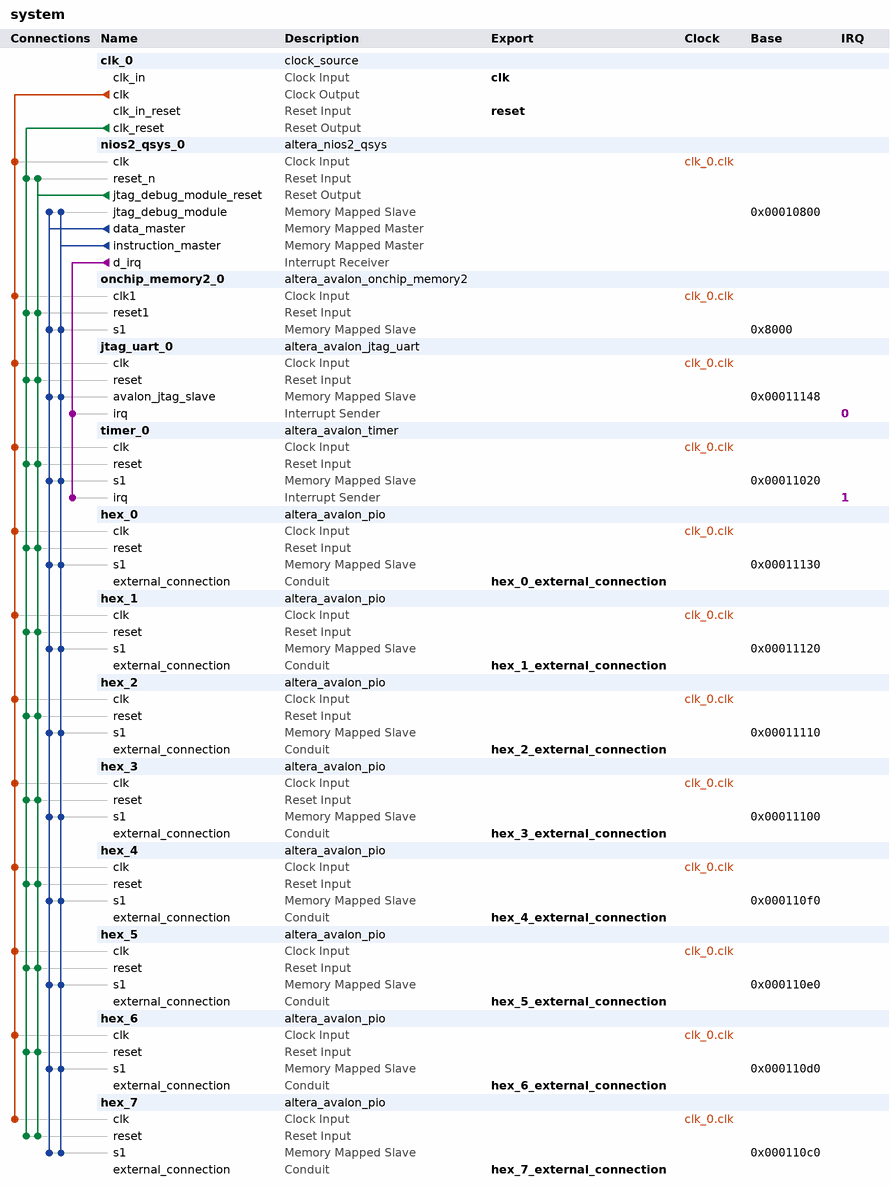
[diagram p0: system contents]
# Platform Designer (Qsys) system system, Cyclone IV E EP4CE115F29C8
# Parameters at their usual value, and those the tool derives, are not listed.
package require -exact qsys 13.0.1.99.2
create_system system
set_project_property DEVICE_FAMILY {Cyclone IV E}
set_project_property DEVICE EP4CE115F29C8

add_instance clk_0 clock_source 13.0
set_instance_parameter_value clk_0 clockFrequency 50000000

add_instance nios2_qsys_0 altera_nios2_qsys 13.0
set_instance_parameter_value nios2_qsys_0 resetSlave onchip_memory2_0.s1
set_instance_parameter_value nios2_qsys_0 mmu_TLBMissExcSlave None
set_instance_parameter_value nios2_qsys_0 exceptionSlave onchip_memory2_0.s1
set_instance_parameter_value nios2_qsys_0 breakSlave nios2_qsys_0.jtag_debug_module
set_instance_parameter_value nios2_qsys_0 impl Tiny
set_instance_parameter_value nios2_qsys_0 icache_size 4096

add_instance onchip_memory2_0 altera_avalon_onchip_memory2 13.0.1.99.2
set_instance_parameter_value onchip_memory2_0 dataWidth 32
set_instance_parameter_value onchip_memory2_0 dualPort false
set_instance_parameter_value onchip_memory2_0 initMemContent true
set_instance_parameter_value onchip_memory2_0 initializationFileName onchip_mem.hex
set_instance_parameter_value onchip_memory2_0 memorySize 32768

add_instance jtag_uart_0 altera_avalon_jtag_uart 13.0.1.99.2
set_instance_parameter_value jtag_uart_0 simInteractiveOptions NO_INTERACTIVE_WINDOWS

add_instance timer_0 altera_avalon_timer 13.0.1.99.2
set_instance_parameter_value timer_0 period 1
set_instance_parameter_value timer_0 periodUnits MSEC

add_instance hex_0 altera_avalon_pio 13.0.1.99.2
set_instance_parameter_value hex_0 direction Output
set_instance_parameter_value hex_0 width 7

add_instance hex_1 altera_avalon_pio 13.0.1.99.2
set_instance_parameter_value hex_1 direction Output
set_instance_parameter_value hex_1 width 7

add_instance hex_2 altera_avalon_pio 13.0.1.99.2
set_instance_parameter_value hex_2 direction Output
set_instance_parameter_value hex_2 width 7

add_instance hex_3 altera_avalon_pio 13.0.1.99.2
set_instance_parameter_value hex_3 direction Output
set_instance_parameter_value hex_3 width 7

add_instance hex_4 altera_avalon_pio 13.0.1.99.2
set_instance_parameter_value hex_4 direction Output
set_instance_parameter_value hex_4 width 7

add_instance hex_5 altera_avalon_pio 13.0.1.99.2
set_instance_parameter_value hex_5 direction Output
set_instance_parameter_value hex_5 width 7

add_instance hex_6 altera_avalon_pio 13.0.1.99.2
set_instance_parameter_value hex_6 direction Output
set_instance_parameter_value hex_6 width 7

add_instance hex_7 altera_avalon_pio 13.0.1.99.2
set_instance_parameter_value hex_7 direction Output
set_instance_parameter_value hex_7 width 7

# connections
add_connection clk_0.clk hex_0.clk clock
add_connection clk_0.clk hex_1.clk clock
add_connection clk_0.clk hex_2.clk clock
add_connection clk_0.clk hex_3.clk clock
add_connection clk_0.clk hex_4.clk clock
add_connection clk_0.clk hex_5.clk clock
add_connection clk_0.clk hex_6.clk clock
add_connection clk_0.clk hex_7.clk clock
add_connection clk_0.clk jtag_uart_0.clk clock
add_connection clk_0.clk nios2_qsys_0.clk clock
add_connection clk_0.clk onchip_memory2_0.clk1 clock
add_connection clk_0.clk timer_0.clk clock
add_connection clk_0.clk_reset hex_0.reset reset
add_connection clk_0.clk_reset hex_1.reset reset
add_connection clk_0.clk_reset hex_2.reset reset
add_connection clk_0.clk_reset hex_3.reset reset
add_connection clk_0.clk_reset hex_4.reset reset
add_connection clk_0.clk_reset hex_5.reset reset
add_connection clk_0.clk_reset hex_6.reset reset
add_connection clk_0.clk_reset hex_7.reset reset
add_connection clk_0.clk_reset jtag_uart_0.reset reset
add_connection clk_0.clk_reset nios2_qsys_0.reset_n reset
add_connection clk_0.clk_reset onchip_memory2_0.reset1 reset
add_connection clk_0.clk_reset timer_0.reset reset
add_connection nios2_qsys_0.jtag_debug_module_reset hex_0.reset reset
add_connection nios2_qsys_0.jtag_debug_module_reset hex_1.reset reset
add_connection nios2_qsys_0.jtag_debug_module_reset hex_2.reset reset
add_connection nios2_qsys_0.jtag_debug_module_reset hex_3.reset reset
add_connection nios2_qsys_0.jtag_debug_module_reset hex_4.reset reset
add_connection nios2_qsys_0.jtag_debug_module_reset hex_5.reset reset
add_connection nios2_qsys_0.jtag_debug_module_reset hex_6.reset reset
add_connection nios2_qsys_0.jtag_debug_module_reset hex_7.reset reset
add_connection nios2_qsys_0.jtag_debug_module_reset jtag_uart_0.reset reset
add_connection nios2_qsys_0.jtag_debug_module_reset nios2_qsys_0.reset_n reset
add_connection nios2_qsys_0.jtag_debug_module_reset onchip_memory2_0.reset1 reset
add_connection nios2_qsys_0.jtag_debug_module_reset timer_0.reset reset
add_connection nios2_qsys_0.data_master hex_0.s1 avalon
set_connection_parameter_value nios2_qsys_0.data_master/hex_0.s1 baseAddress 0x00011130
add_connection nios2_qsys_0.data_master hex_1.s1 avalon
set_connection_parameter_value nios2_qsys_0.data_master/hex_1.s1 baseAddress 0x00011120
add_connection nios2_qsys_0.data_master hex_2.s1 avalon
set_connection_parameter_value nios2_qsys_0.data_master/hex_2.s1 baseAddress 0x00011110
add_connection nios2_qsys_0.data_master hex_3.s1 avalon
set_connection_parameter_value nios2_qsys_0.data_master/hex_3.s1 baseAddress 0x00011100
add_connection nios2_qsys_0.data_master hex_4.s1 avalon
set_connection_parameter_value nios2_qsys_0.data_master/hex_4.s1 baseAddress 0x000110f0
add_connection nios2_qsys_0.data_master hex_5.s1 avalon
set_connection_parameter_value nios2_qsys_0.data_master/hex_5.s1 baseAddress 0x000110e0
add_connection nios2_qsys_0.data_master hex_6.s1 avalon
set_connection_parameter_value nios2_qsys_0.data_master/hex_6.s1 baseAddress 0x000110d0
add_connection nios2_qsys_0.data_master hex_7.s1 avalon
set_connection_parameter_value nios2_qsys_0.data_master/hex_7.s1 baseAddress 0x000110c0
add_connection nios2_qsys_0.data_master jtag_uart_0.avalon_jtag_slave avalon
set_connection_parameter_value nios2_qsys_0.data_master/jtag_uart_0.avalon_jtag_slave baseAddress 0x00011148
add_connection nios2_qsys_0.data_master nios2_qsys_0.jtag_debug_module avalon
set_connection_parameter_value nios2_qsys_0.data_master/nios2_qsys_0.jtag_debug_module baseAddress 0x00010800
add_connection nios2_qsys_0.data_master onchip_memory2_0.s1 avalon
set_connection_parameter_value nios2_qsys_0.data_master/onchip_memory2_0.s1 baseAddress 0x8000
add_connection nios2_qsys_0.data_master timer_0.s1 avalon
set_connection_parameter_value nios2_qsys_0.data_master/timer_0.s1 baseAddress 0x00011020
add_connection nios2_qsys_0.instruction_master hex_0.s1 avalon
set_connection_parameter_value nios2_qsys_0.instruction_master/hex_0.s1 baseAddress 0x00011130
add_connection nios2_qsys_0.instruction_master hex_1.s1 avalon
set_connection_parameter_value nios2_qsys_0.instruction_master/hex_1.s1 baseAddress 0x00011120
add_connection nios2_qsys_0.instruction_master hex_2.s1 avalon
set_connection_parameter_value nios2_qsys_0.instruction_master/hex_2.s1 baseAddress 0x00011110
add_connection nios2_qsys_0.instruction_master hex_3.s1 avalon
set_connection_parameter_value nios2_qsys_0.instruction_master/hex_3.s1 baseAddress 0x00011100
add_connection nios2_qsys_0.instruction_master hex_4.s1 avalon
set_connection_parameter_value nios2_qsys_0.instruction_master/hex_4.s1 baseAddress 0x000110f0
add_connection nios2_qsys_0.instruction_master hex_5.s1 avalon
set_connection_parameter_value nios2_qsys_0.instruction_master/hex_5.s1 baseAddress 0x000110e0
add_connection nios2_qsys_0.instruction_master hex_6.s1 avalon
set_connection_parameter_value nios2_qsys_0.instruction_master/hex_6.s1 baseAddress 0x000110d0
add_connection nios2_qsys_0.instruction_master hex_7.s1 avalon
set_connection_parameter_value nios2_qsys_0.instruction_master/hex_7.s1 baseAddress 0x000110c0
add_connection nios2_qsys_0.instruction_master jtag_uart_0.avalon_jtag_slave avalon
set_connection_parameter_value nios2_qsys_0.instruction_master/jtag_uart_0.avalon_jtag_slave baseAddress 0x00011148
add_connection nios2_qsys_0.instruction_master nios2_qsys_0.jtag_debug_module avalon
set_connection_parameter_value nios2_qsys_0.instruction_master/nios2_qsys_0.jtag_debug_module baseAddress 0x00010800
add_connection nios2_qsys_0.instruction_master onchip_memory2_0.s1 avalon
set_connection_parameter_value nios2_qsys_0.instruction_master/onchip_memory2_0.s1 baseAddress 0x8000
add_connection nios2_qsys_0.instruction_master timer_0.s1 avalon
set_connection_parameter_value nios2_qsys_0.instruction_master/timer_0.s1 baseAddress 0x00011020
add_connection nios2_qsys_0.d_irq jtag_uart_0.irq interrupt
set_connection_parameter_value nios2_qsys_0.d_irq/jtag_uart_0.irq irqNumber 0
add_connection nios2_qsys_0.d_irq timer_0.irq interrupt
set_connection_parameter_value nios2_qsys_0.d_irq/timer_0.irq irqNumber 1

# exported interfaces
add_interface clk clock sink
set_interface_property clk EXPORT_OF clk_0.clk_in
add_interface reset reset sink
set_interface_property reset EXPORT_OF clk_0.clk_in_reset
add_interface hex_0_external_connection conduit end
set_interface_property hex_0_external_connection EXPORT_OF hex_0.external_connection
add_interface hex_1_external_connection conduit end
set_interface_property hex_1_external_connection EXPORT_OF hex_1.external_connection
add_interface hex_2_external_connection conduit end
set_interface_property hex_2_external_connection EXPORT_OF hex_2.external_connection
add_interface hex_3_external_connection conduit end
set_interface_property hex_3_external_connection EXPORT_OF hex_3.external_connection
add_interface hex_4_external_connection conduit end
set_interface_property hex_4_external_connection EXPORT_OF hex_4.external_connection
add_interface hex_5_external_connection conduit end
set_interface_property hex_5_external_connection EXPORT_OF hex_5.external_connection
add_interface hex_6_external_connection conduit end
set_interface_property hex_6_external_connection EXPORT_OF hex_6.external_connection
add_interface hex_7_external_connection conduit end
set_interface_property hex_7_external_connection EXPORT_OF hex_7.external_connection

set_interconnect_requirement {$system} qsys_mm.clockCrossingAdapter HANDSHAKE
set_interconnect_requirement {$system} qsys_mm.maxAdditionalLatency 1

save_system system.qsys
